# Altium schematic sheet 其他外设.SchDoc
size A3
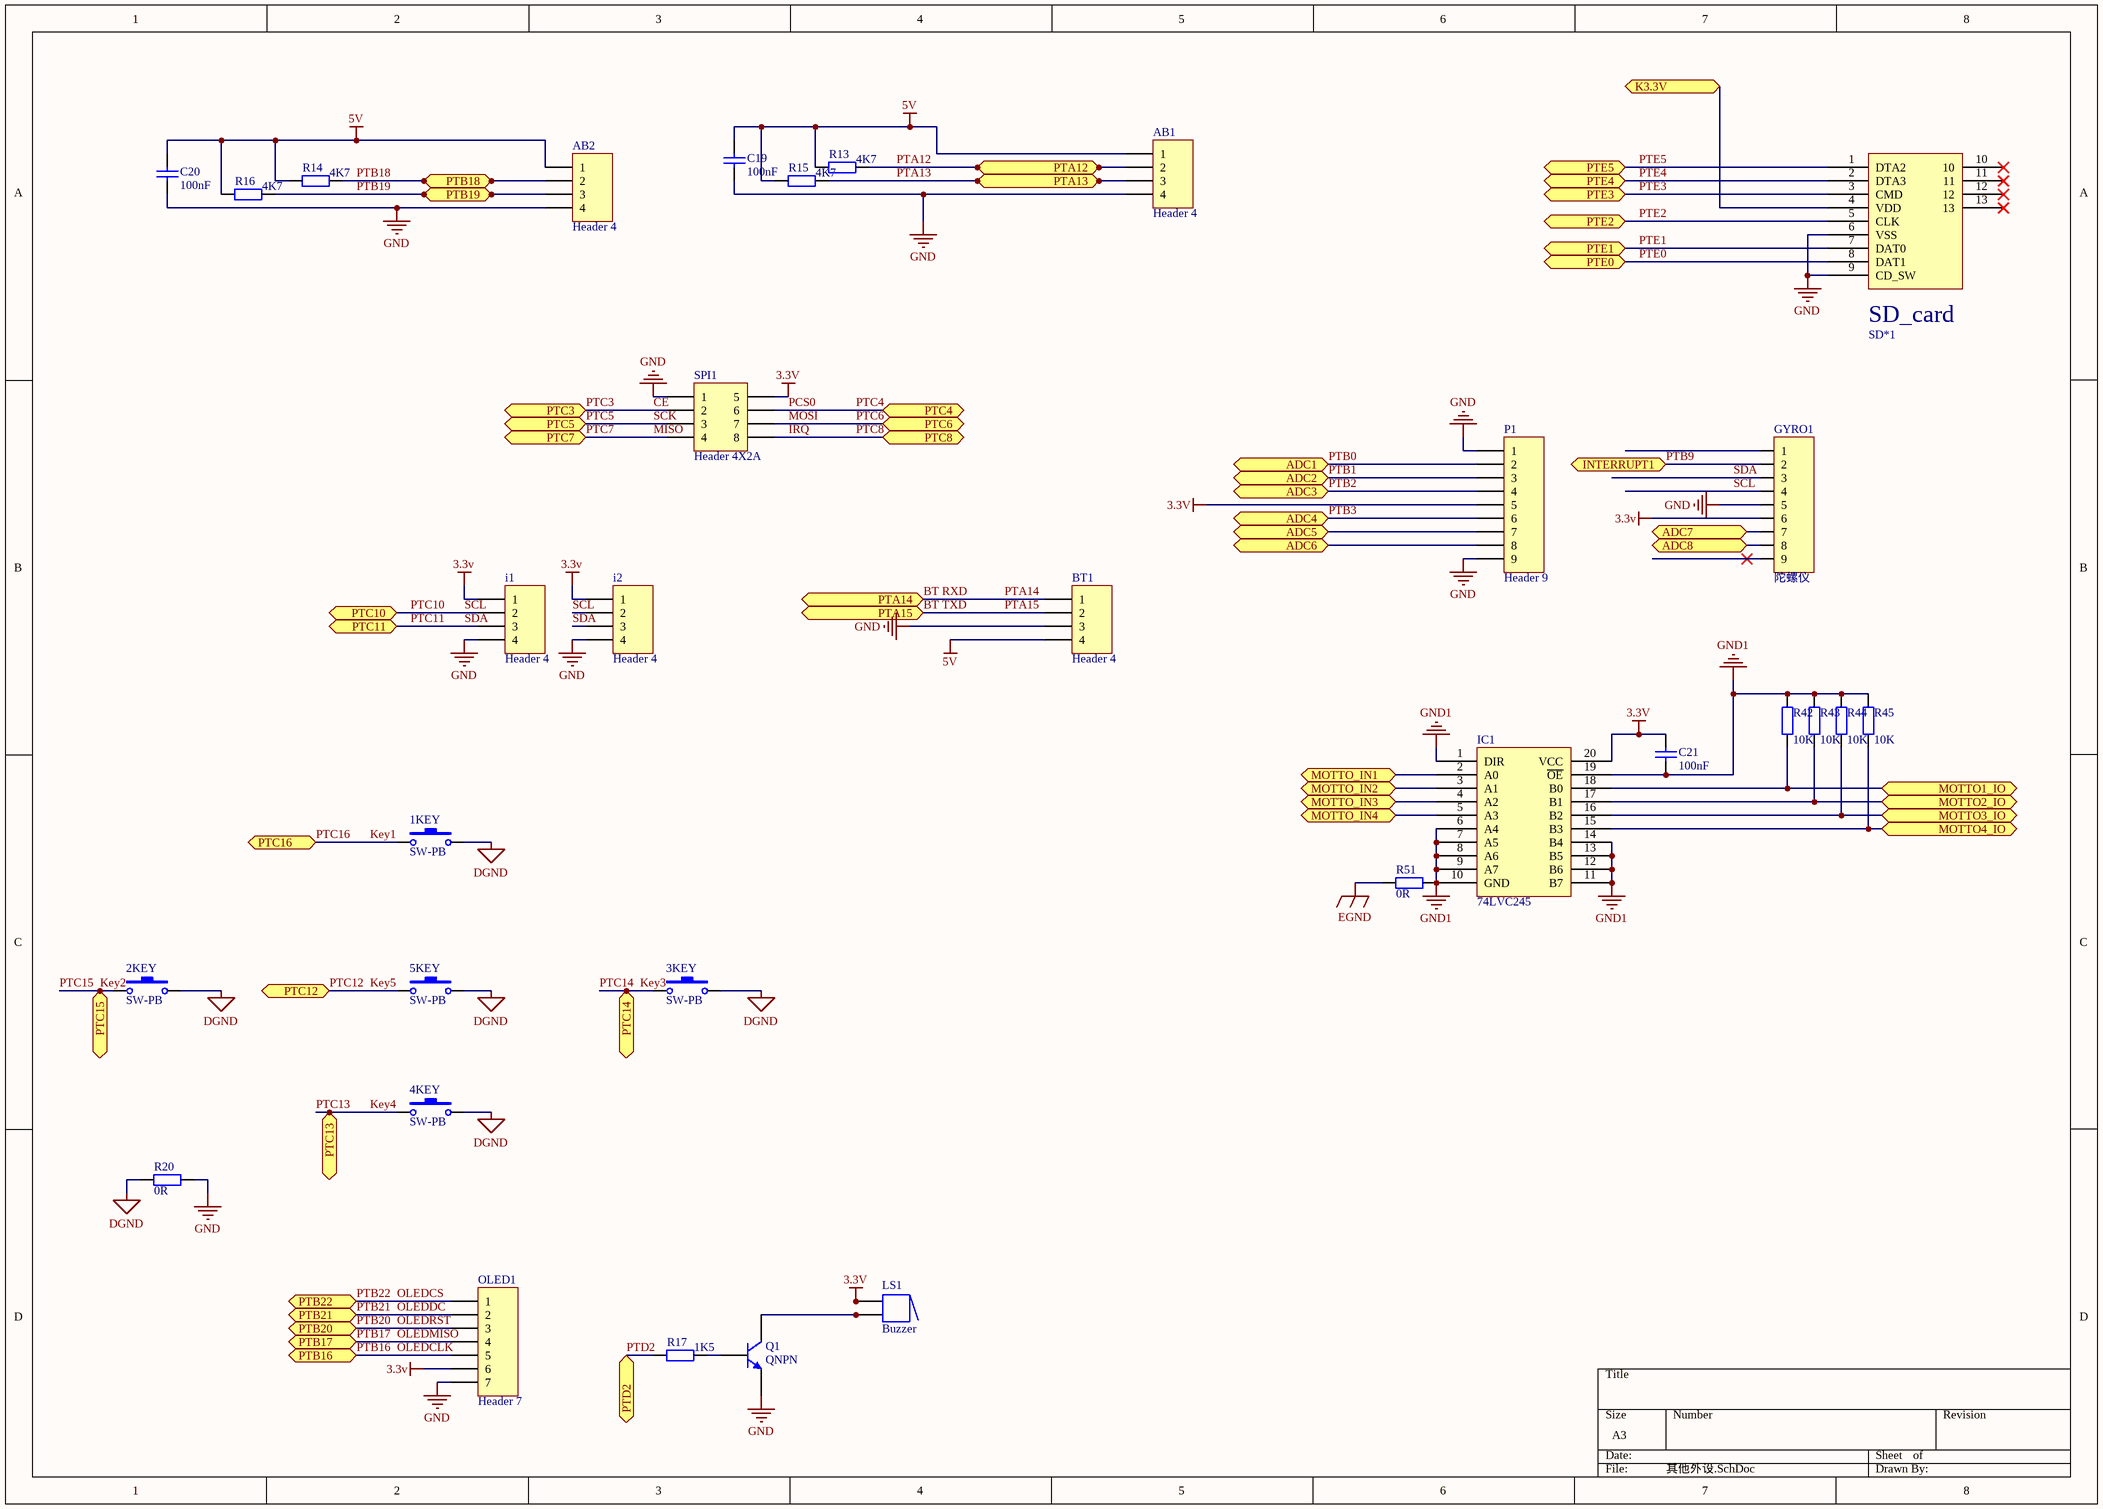
[diagram p0: 其他外设.SchDoc]

## Parts
1KEY  SW-PB  [sw 3*4 *2]
2KEY  SW-PB  [sw 3*4 *2]
3KEY  SW-PB  [sw 3*4 *2]
4KEY  SW-PB  [sw 3*4 *2]
5KEY  SW-PB  [sw 3*4 *2]
AB1  Header 4  [HDR1X4]
AB2  Header 4  [HDR1X4]
BT1  Header 4  [HDR1X4]
C19  100nF  [C2012]
C20  100nF  [C2012]
C21  100nF  [C2012]
GYRO1  陀螺仪  [landzo_AngularRate_Accelerometer_Sensor]
i1  Header 4  [HDR1X4]
i2  Header 4  [HDR1X4]
IC1  74LVC245  [TSSOP20 74lvc245]
LS1  Buzzer  [ABSM-1574]
OLED1  Header 7  [HDR1X7]
P1  Header 9  [HDR1X9]
Q1  QNPN  [SOT95P240-3N]
R13  value 4K7  [R2012]  (hidden comment: Res2)
R14  value 4K7  [R2012]  (hidden comment: Res2)
R15  value 4K7  [R2012]  (hidden comment: Res2)
R16  value 4K7  [R2012]  (hidden comment: Res2)
R17  value 1K5  [R2012]  (hidden comment: Res2)
R20  0R  [R2012]
R42  value 10K  [R2012]  (hidden comment: Res2)
R43  value 10K  [R2012]  (hidden comment: Res2)
R44  value 10K  [R2012]  (hidden comment: Res2)
R45  value 10K  [R2012]  (hidden comment: Res2)
R51  value 0R  [1206(2)]  (hidden comment: Res2)
SD*1  TF_card  [SD_card]  (value not drawn)
SPI1  Header 4X2A  [SMT head4*1]

## Ports
ADC1, ADC2, ADC3, ADC4, ADC5, ADC6, ADC7, ADC8, INTERRUPT1, K3.3V, MOTTO1_IO, MOTTO2_IO, MOTTO3_IO, MOTTO4_IO, MOTTO_IN1, MOTTO_IN2, MOTTO_IN3, MOTTO_IN4, PTA12, PTA13, PTA14, PTA15, PTB16, PTB17, PTB18, PTB19, PTB20, PTB21, PTB22, PTC3, PTC4, PTC5, PTC6, PTC7, PTC8, PTC10, PTC11, PTC12, PTC13, PTC14, PTC15, PTC16, PTD2, PTE0, PTE1, PTE2, PTE3, PTE4, PTE5

## Nets
3.3v: C21.1 GYRO1.6 i1.1 i2.1 IC1.20(VCC) LS1.1 LS1.1A OLED1.6 P1.5 SPI1.5
5V: AB1.1 AB2.1 BT1.4 C19.1 C20.1 R13.2 R14.2 R15.2 R16.2
DGND: 1KEY.2 2KEY.2 3KEY.2 4KEY.2 5KEY.2 R20.2
EGND: R51.1
GND: AB1.4 AB2.4 BT1.3 C19.2 C20.2 GYRO1.5 i1.4 i2.4 OLED1.7 P1.1 P1.9 Q1.3(E) R20.1 SD*1.6(VSS) SD*1.9(CD_SW) SPI1.1
GND1: C21.2 IC1.1(DIR) IC1.6(A4) IC1.7(A5) IC1.8(A6) IC1.9(A7) IC1.10(GND) IC1.11(B7) IC1.12(B6) IC1.13(B5) IC1.14(B4) IC1.19(~{OE}) R42.2 R43.2 R44.2 R45.2 R51.2
ADC5: P1.7 ; port ADC5
ADC6: P1.8 ; port ADC6
ADC7: GYRO1.7 ; port ADC7
ADC8: GYRO1.8 ; port ADC8
BT RXD: BT1.1 ; port PTA14  [also labelled PTA14]
BT TXD: BT1.2 ; port PTA15  [also labelled PTA15]
CE: SPI1.2 ; port PTC3  [also labelled PTC3]
IRQ: SPI1.8 ; port PTC8  [also labelled PTC8]
K3.3V: SD*1.4(VDD) ; port K3.3V
Key1: 1KEY.1 ; port PTC16  [also labelled PTC16]
Key2: 2KEY.1 ; port PTC15  [also labelled PTC15]
Key3: 3KEY.1 ; port PTC14  [also labelled PTC14]
Key4: 4KEY.1 ; port PTC13  [also labelled PTC13]
Key5: 5KEY.1 ; port PTC12  [also labelled PTC12]
MISO: SPI1.4 ; port PTC7  [also labelled PTC7]
MOSI: SPI1.7 ; port PTC6  [also labelled PTC6]
MOTTO1_IO: IC1.18(B0) R42.1 ; port MOTTO1_IO
MOTTO2_IO: IC1.17(B1) R43.1 ; port MOTTO2_IO
MOTTO3_IO: IC1.16(B2) R44.1 ; port MOTTO3_IO
MOTTO4_IO: IC1.15(B3) R45.1 ; port MOTTO4_IO
MOTTO_IN1: IC1.2(A0) ; port MOTTO_IN1
MOTTO_IN2: IC1.3(A1) ; port MOTTO_IN2
MOTTO_IN3: IC1.4(A2) ; port MOTTO_IN3
MOTTO_IN4: IC1.5(A3) ; port MOTTO_IN4
OLEDCLK: OLED1.5 ; port PTB16  [also labelled PTB16]
OLEDCS: OLED1.1 ; port PTB22  [also labelled PTB22]
OLEDDC: OLED1.2 ; port PTB21  [also labelled PTB21]
OLEDMISO: OLED1.4 ; port PTB17  [also labelled PTB17]
OLEDRST: OLED1.3 ; port PTB20  [also labelled PTB20]
PCS0: SPI1.6 ; port PTC4  [also labelled PTC4]
PTA12: AB1.2 R13.1 ; port PTA12
PTA13: AB1.3 R15.1 ; port PTA13
PTB0: P1.2 ; port ADC1
PTB1: P1.3 ; port ADC2
PTB2: P1.4 ; port ADC3
PTB3: P1.6 ; port ADC4
PTB9: GYRO1.2 ; port INTERRUPT1
PTB18: AB2.2 R14.1 ; port PTB18
PTB19: AB2.3 R16.1 ; port PTB19
PTC5: SPI1.3 ; port PTC5  [also labelled SCK]
PTC10: GYRO1.4 i1.2 i2.2 ; port PTC10  [also labelled SCL]
PTC11: GYRO1.3 i1.3 i2.3 ; port PTC11  [also labelled SDA]
PTD2: R17.2 ; port PTD2
PTE0: SD*1.8(DAT1) ; port PTE0
PTE1: SD*1.7(DAT0) ; port PTE1
PTE2: SD*1.5(CLK) ; port PTE2
PTE3: SD*1.3(CMD) ; port PTE3
PTE4: SD*1.2(DTA3) ; port PTE4
PTE5: SD*1.1(DTA2) ; port PTE5
NetLS1_2: LS1.2 LS1.2A Q1.1(C)
NetQ1_2: Q1.2(B) R17.1

Not connected (* = marked no-connect by the designer): GYRO1 1 9*; SD*1 10* 11* 12* 13*

## Notes on the sheet
- (in symbol TF_card) SD_card

## Library data of the parts
1KEY 2KEY 3KEY 4KEY 5KEY = SW-PB: Switch
AB1 AB2 BT1 i1 i2 = Header 4: Header, 4-Pin; LatestRevisionDate: 17-Jul-2002; LatestRevisionNote: Re-released for DXP Platform.; Publisher: Altium Limited
C19-C21 = Cap: Capacitor
GYRO1 = Header 9: Header, 8-Pin
LS1 = Buzzer: Magnetic Transducer Buzzer; pin to pad: 1>1A 2>2A; Published: 24-Mar-1999; LatestRevisionDate: 17-Dec-2003; LatestRevisionNote: Schematic revised, PCB Footprint replaced.; DatasheetVersion: 17-Dec-2003; PackageReference: ABSM-1574; Publisher: Altium Limited; ComponentLink1Description: Manufacturer Link; ComponentLink1URL: http://www.megastar.com/linecard/buzzmode/index.php
OLED1 = Header 7: Header, 7-Pin; LatestRevisionDate: 17-Jul-2002; LatestRevisionNote: Re-released for DXP Platform.; Publisher: Altium Limited
P1 = Header 9: Header, 9-Pin; LatestRevisionDate: 17-Jul-2002; LatestRevisionNote: Re-released for DXP Platform.; Publisher: Altium Limited
Q1 = QNPN: NPN Bipolar Transistor; pin to pad: 1>3 2>1 3>2; Published: 8-Jun-2000; LatestRevisionDate: 29-May-2009; LatestRevisionNote: IPC-7351 Footprint Added.; PackageVersion: Aug-1999; PackageReference: SOT-23B; Publisher: Altium Limited; PackageDescription: 3-Pin SOT-23 Package 0.95 mm Pitch, 2.4 mm Lead Span
R13-R17 R42-R45 R51 = Res2: Resistor; Published: 8-Jun-2000; LatestRevisionDate: 17-Jul-2002; LatestRevisionNote: Re-released for DXP Platform.; PackageReference: AXIAL-0.4; Publisher: Altium Limited; PackageDescription: Axial Device, Thru-Hole; 2 Leads; 0.4 in Pin Spacing
R20 = Res: Resistor of led
SPI1 = Header 4X2A: Header, 4-Pin, Dual row; LatestRevisionDate: 17-Jul-2002; LatestRevisionNote: Re-released for DXP Platform.; Publisher: Altium Limited